# EAGLE schematic schematic (EAGLE 7.3.0)
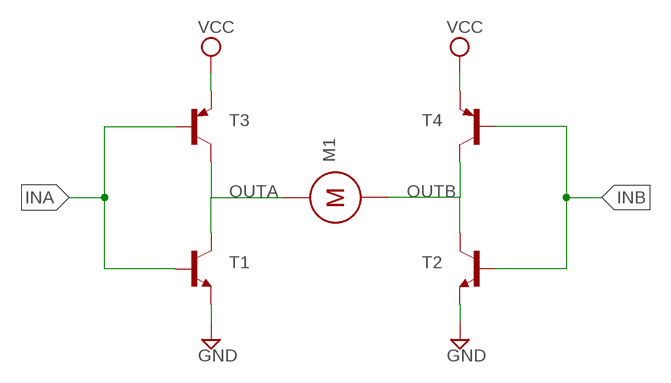
[diagram p0: schematic, sheet 1]

## Parts
M1  308-100  [308-100]
T1  2N3904  [TO92]
T2  2N3904  [TO92]
T3  2N3906  [TO92]
T4  2N3906  [TO92]

## Nets
GND: T1.3(E) T2.3(E)
INA: T1.2(B) T3.1(B)
INB: T2.2(B) T4.1(B)
OUTA: M1.POS T1.1(C) T3.2(C)
OUTB: M1.NEG T2.1(C) T4.2(C)
VCC: T3.3(E) T4.3(E)

## Library data of the parts
M1 = motor:308-100: Pico Vibe 8mm Vibration Motor - 3mm Type; PRECISION_MICRODRIVES: 308-100
T1 T2 = transistor:2N3904: NPN TRANSISTOR
T3 T4 = transistor:2N3906: PNP TRANSISTOR